# Altium schematic sheet STM32 BOARD.SchDoc
size B
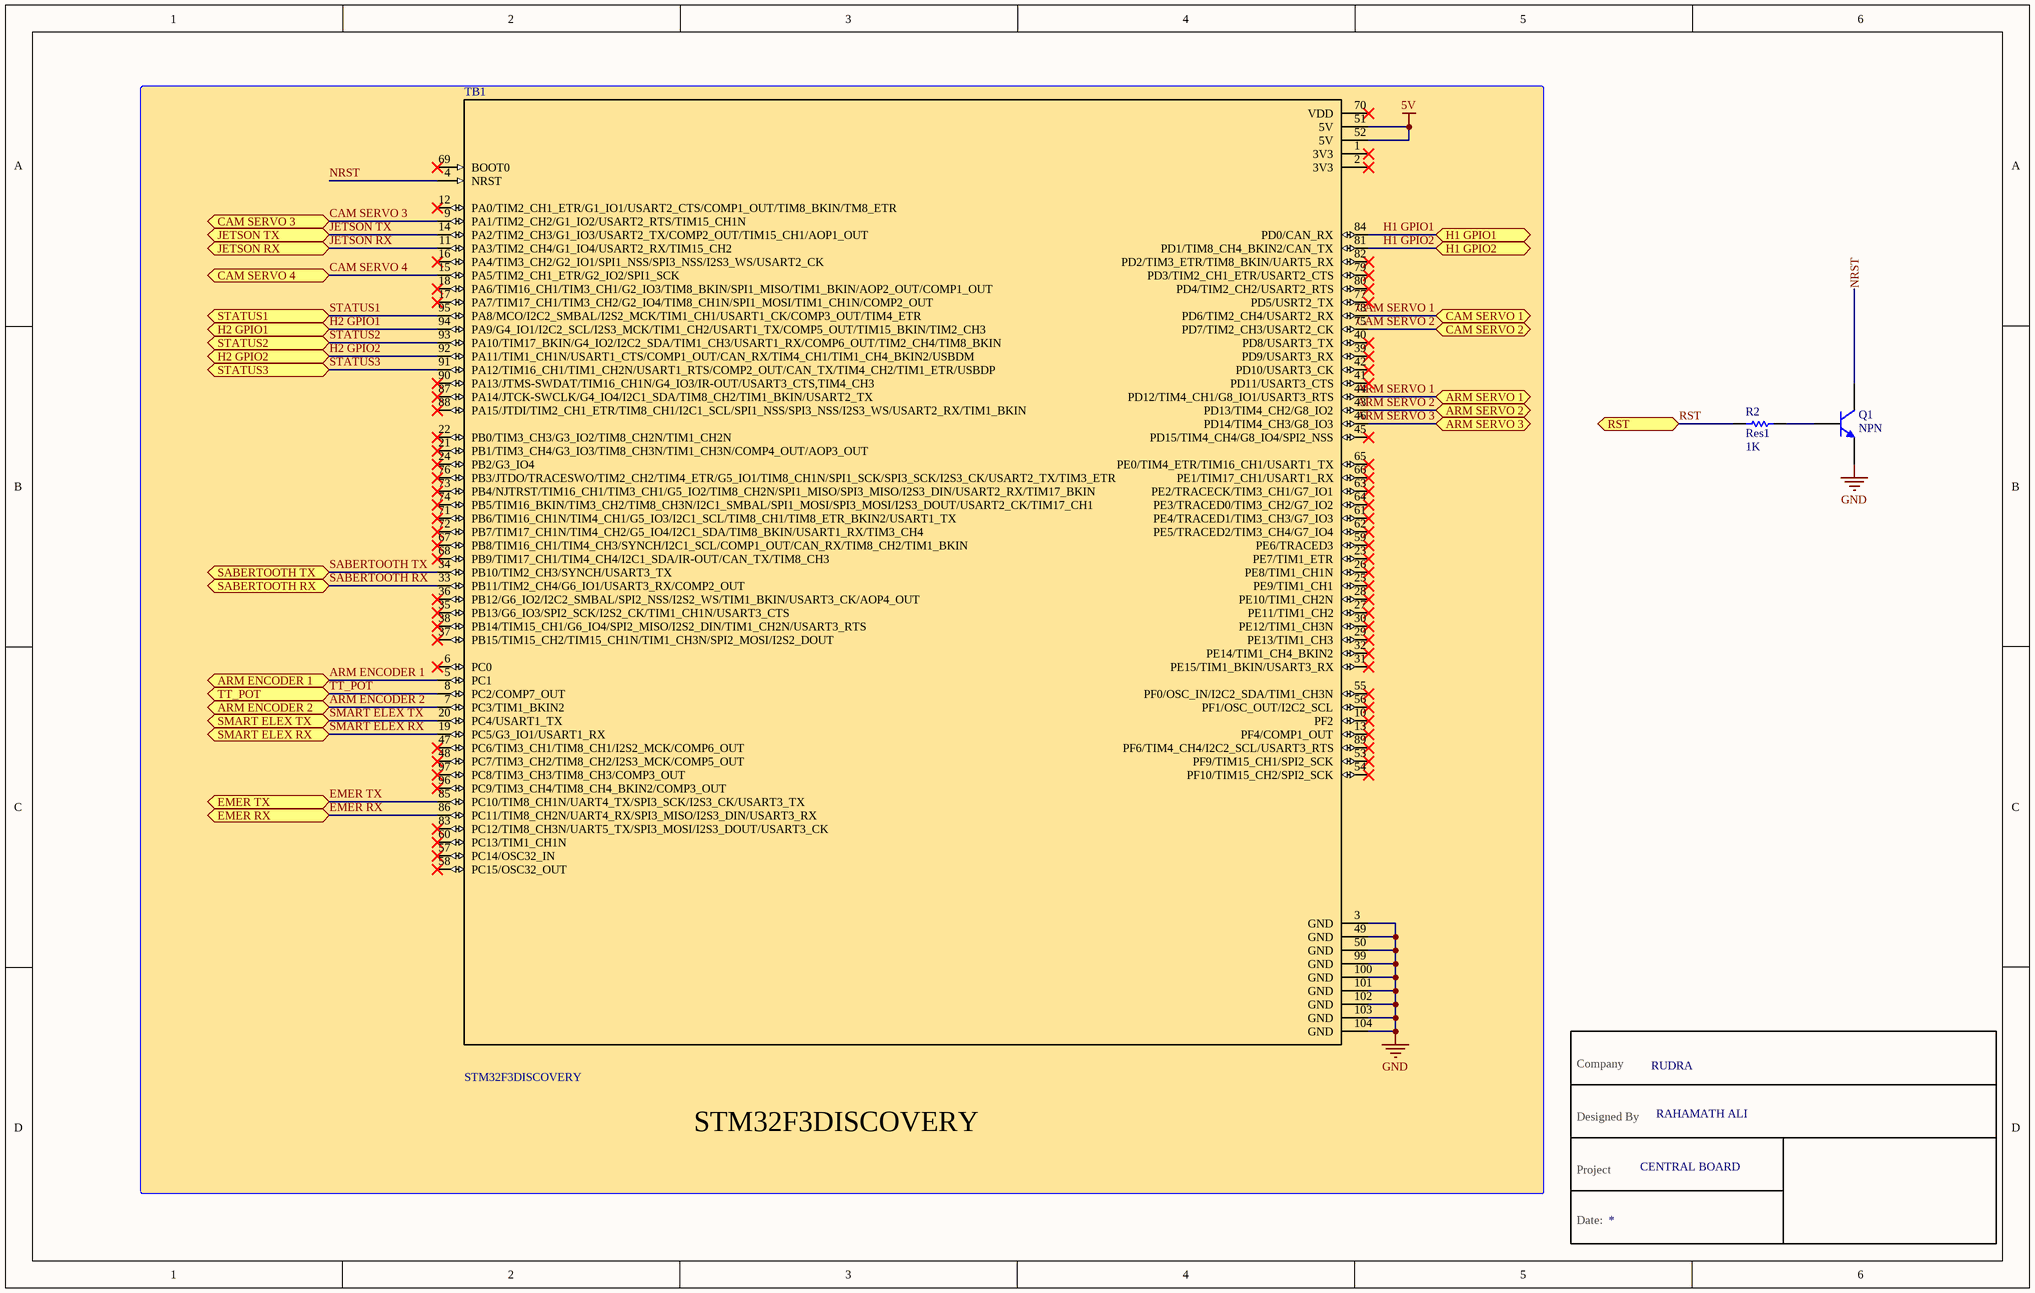
[diagram p0: STM32 BOARD.SchDoc]

## Parts
1  Project: CENTRAL BOARD  Designed By: RAHAMATH ALI  Company: RUDRA  (hidden comment: Schematic Table)  (graphical)
Q1  NPN  [TO-226-AA]
R2  Res1  value 1K  [AXIAL-0.3]
TB1  STM32F3DISCOVERY  [SHIELD_STM32F3DISCOVERY]

## Blocks framed on the sheet
STM32F3DISCOVERY: TB1

## Ports
ARM ENCODER 1 (bidir), ARM ENCODER 2 (bidir), ARM SERVO 1 (bidir), ARM SERVO 2 (bidir), ARM SERVO 3 (bidir), CAM SERVO 1 (bidir), CAM SERVO 2 (bidir), CAM SERVO 3 (bidir), CAM SERVO 4 (bidir), EMER RX (bidir), EMER TX (bidir), H1 GPIO1 (bidir), H1 GPIO2 (bidir), H2 GPIO1 (bidir), H2 GPIO2 (bidir), JETSON RX (bidir), JETSON TX (bidir), RST (bidir), SABERTOOTH RX (bidir), SABERTOOTH TX (bidir), SMART ELEX RX (bidir), SMART ELEX TX (bidir), STATUS1 (bidir), STATUS2 (bidir), STATUS3 (bidir), TT_POT (bidir)

## Nets
5V: TB1.51(5V) TB1.52(5V)
GND: Q1.3(E) TB1.3(GND) TB1.49(GND) TB1.50(GND) TB1.99(GND) TB1.100(GND) TB1.101(GND) TB1.102(GND) TB1.103(GND) TB1.104(GND)
ARM ENCODER 1: TB1.5(PC1) ; port ARM ENCODER 1
ARM ENCODER 2: TB1.7(PC3/TIM1_BKIN2) ; port ARM ENCODER 2
ARM SERVO 1: TB1.44(PD12/TIM4_CH1/G8_IO1/USART3_RTS) ; port ARM SERVO 1
ARM SERVO 2: TB1.43(PD13/TIM4_CH2/G8_IO2) ; port ARM SERVO 2
ARM SERVO 3: TB1.46(PD14/TIM4_CH3/G8_IO3) ; port ARM SERVO 3
CAM SERVO 1: TB1.78(PD6/TIM2_CH4/USART2_RX) ; port CAM SERVO 1
CAM SERVO 2: TB1.75(PD7/TIM2_CH3/USART2_CK) ; port CAM SERVO 2
CAM SERVO 3: TB1.9(PA1/TIM2_CH2/G1_IO2/USART2_RTS/TIM15_CH1N) ; port CAM SERVO 3
CAM SERVO 4: TB1.15(PA5/TIM2_CH1_ETR/G2_IO2/SPI1_SCK) ; port CAM SERVO 4
EMER RX: TB1.86(PC11/TIM8_CH2N/UART4_RX/SPI3_MISO/I2S3_DIN/USART3_RX) ; port EMER RX
EMER TX: TB1.85(PC10/TIM8_CH1N/UART4_TX/SPI3_SCK/I2S3_CK/USART3_TX) ; port EMER TX
H1 GPIO1: TB1.84(PD0/CAN_RX) ; port H1 GPIO1
H1 GPIO2: TB1.81(PD1/TIM8_CH4_BKIN2/CAN_TX) ; port H1 GPIO2
H2 GPIO1: TB1.94(PA9/G4_IO1/I2C2_SCL/I2S3_MCK/TIM1_CH2/USART1_TX/COMP5_OUT/TIM15_BKIN/TIM2_CH3) ; port H2 GPIO1
H2 GPIO2: TB1.92(PA11/TIM1_CH1N/USART1_CTS/COMP1_OUT/CAN_RX/TIM4_CH1/TIM1_CH4_BKIN2/USBDM) ; port H2 GPIO2
JETSON RX: TB1.11(PA3/TIM2_CH4/G1_IO4/USART2_RX/TIM15_CH2) ; port JETSON RX
JETSON TX: TB1.14(PA2/TIM2_CH3/G1_IO3/USART2_TX/COMP2_OUT/TIM15_CH1/AOP1_OUT) ; port JETSON TX
NRST: Q1.1(C) TB1.4(NRST)
RST: R2.1 ; port RST
SABERTOOTH RX: TB1.33(PB11/TIM2_CH4/G6_IO1/USART3_RX/COMP2_OUT) ; port SABERTOOTH RX
SABERTOOTH TX: TB1.34(PB10/TIM2_CH3/SYNCH/USART3_TX) ; port SABERTOOTH TX
SMART ELEX RX: TB1.19(PC5/G3_IO1/USART1_RX) ; port SMART ELEX RX
SMART ELEX TX: TB1.20(PC4/USART1_TX) ; port SMART ELEX TX
STATUS1: TB1.95(PA8/MCO/I2C2_SMBAL/I2S2_MCK/TIM1_CH1/USART1_CK/COMP3_OUT/TIM4_ETR) ; port STATUS1
STATUS2: TB1.93(PA10/TIM17_BKIN/G4_IO2/I2C2_SDA/TIM1_CH3/USART1_RX/COMP6_OUT/TIM2_CH4/TIM8_BKIN) ; port STATUS2
STATUS3: TB1.91(PA12/TIM16_CH1/TIM1_CH2N/USART1_RTS/COMP2_OUT/CAN_TX/TIM4_CH2/TIM1_ETR/USBDP) ; port STATUS3
TT_POT: TB1.8(PC2/COMP7_OUT) ; port TT_POT
NetQ1_2: Q1.2(B) R2.2

Not connected (* = marked no-connect by the designer): TB1 1(3V3)* 2(3V3)* 6(PC0)* 10(PF2)* 12(PA0/TIM2_CH1_ETR/G1_IO1/USART2_CTS/COMP1_OUT/TIM8_BKIN/TM8_ETR)* 13(PF4/COMP1_OUT)* 16(PA4/TIM3_CH2/G2_IO1/SPI1_NSS/SPI3_NSS/I2S3_WS/USART2_CK)* 17(PA7/TIM17_CH1/TIM3_CH2/G2_IO4/TIM8_CH1N/SPI1_MOSI/TIM1_CH1N/COMP2_OUT)* 18(PA6/TIM16_CH1/TIM3_CH1/G2_IO3/TIM8_BKIN/SPI1_MISO/TIM1_BKIN/AOP2_OUT/COMP1_OUT)* 21(PB1/TIM3_CH4/G3_IO3/TIM8_CH3N/TIM1_CH3N/COMP4_OUT/AOP3_OUT)* 22(PB0/TIM3_CH3/G3_IO2/TIM8_CH2N/TIM1_CH2N)* 23(PE7/TIM1_ETR)* 24(PB2/G3_IO4)* 25(PE9/TIM1_CH1)* 26(PE8/TIM1_CH1N)* 27(PE11/TIM1_CH2)* 28(PE10/TIM1_CH2N)* 29(PE13/TIM1_CH3)* 30(PE12/TIM1_CH3N)* 31(PE15/TIM1_BKIN/USART3_RX)* 32(PE14/TIM1_CH4_BKIN2)* 35(PB13/G6_IO3/SPI2_SCK/I2S2_CK/TIM1_CH1N/USART3_CTS)* 36(PB12/G6_IO2/I2C2_SMBAL/SPI2_NSS/I2S2_WS/TIM1_BKIN/USART3_CK/AOP4_OUT)* 37(PB15/TIM15_CH2/TIM15_CH1N/TIM1_CH3N/SPI2_MOSI/I2S2_DOUT)* 38(PB14/TIM15_CH1/G6_IO4/SPI2_MISO/I2S2_DIN/TIM1_CH2N/USART3_RTS)* 39(PD9/USART3_RX)* 40(PD8/USART3_TX)* 41(PD11/USART3_CTS)* 42(PD10/USART3_CK)* 45(PD15/TIM4_CH4/G8_IO4/SPI2_NSS)* 47(PC6/TIM3_CH1/TIM8_CH1/I2S2_MCK/COMP6_OUT)* 48(PC7/TIM3_CH2/TIM8_CH2/I2S3_MCK/COMP5_OUT)* 53(PF9/TIM15_CH1/SPI2_SCK)* 54(PF10/TIM15_CH2/SPI2_SCK)* 55(PF0/OSC_IN/I2C2_SDA/TIM1_CH3N)* 56(PF1/OSC_OUT/I2C2_SCL)* 57(PC14/OSC32_IN)* 58(PC15/OSC32_OUT)* 59(PE6/TRACED3)* 60(PC13/TIM1_CH1N)* 61(PE4/TRACED1/TIM3_CH3/G7_IO3)* 62(PE5/TRACED2/TIM3_CH4/G7_IO4)* 63(PE2/TRACECK/TIM3_CH1/G7_IO1)* 64(PE3/TRACED0/TIM3_CH2/G7_IO2)* 65(PE0/TIM4_ETR/TIM16_CH1/USART1_TX)* 66(PE1/TIM17_CH1/USART1_RX)* 67(PB8/TIM16_CH1/TIM4_CH3/SYNCH/I2C1_SCL/COMP1_OUT/CAN_RX/TIM8_CH2/TIM1_BKIN)* 68(PB9/TIM17_CH1/TIM4_CH4/I2C1_SDA/IR-OUT/CAN_TX/TIM8_CH3)* 69(BOOT0)* 70(VDD)* 71(PB6/TIM16_CH1N/TIM4_CH1/G5_IO3/I2C1_SCL/TIM8_CH1/TIM8_ETR_BKIN2/USART1_TX)* 72(PB7/TIM17_CH1N/TIM4_CH2/G5_IO4/I2C1_SDA/TIM8_BKIN/USART1_RX/TIM3_CH4)* 73(PB4/NJTRST/TIM16_CH1/TIM3_CH1/G5_IO2/TIM8_CH2N/SPI1_MISO/SPI3_MISO/I2S3_DIN/USART2_RX/TIM17_BKIN)* 74(PB5/TIM16_BKIN/TIM3_CH2/TIM8_CH3N/I2C1_SMBAL/SPI1_MOSI/SPI3_MOSI/I2S3_DOUT/USART2_CK/TIM17_CH1)* 76(PB3/JTDO/TRACESWO/TIM2_CH2/TIM4_ETR/G5_IO1/TIM8_CH1N/SPI1_SCK/SPI3_SCK/I2S3_CK/USART2_TX/TIM3_ETR)* 77(PD5/USRT2_TX)* 79(PD3/TIM2_CH1_ETR/USART2_CTS)* 80(PD4/TIM2_CH2/USART2_RTS)* 82(PD2/TIM3_ETR/TIM8_BKIN/UART5_RX)* 83(PC12/TIM8_CH3N/UART5_TX/SPI3_MOSI/I2S3_DOUT/USART3_CK)* 87(PA14/JTCK-SWCLK/G4_IO4/I2C1_SDA/TIM8_CH2/TIM1_BKIN/USART2_TX)* 88(PA15/JTDI/TIM2_CH1_ETR/TIM8_CH1/I2C1_SCL/SPI1_NSS/SPI3_NSS/I2S3_WS/USART2_RX/TIM1_BKIN)* 89(PF6/TIM4_CH4/I2C2_SCL/USART3_RTS)* 90(PA13/JTMS-SWDAT/TIM16_CH1N/G4_IO3/IR-OUT/USART3_CTS,TIM4_CH3)* 96(PC9/TIM3_CH4/TIM8_CH4_BKIN2/COMP3_OUT)* 97(PC8/TIM3_CH3/TIM8_CH3/COMP3_OUT)*

## Notes on the sheet
- (in symbol Schematic Table) Company; Designed By; Project; Date:

## Library data of the parts
Q1 = NPN: NPN Bipolar Transistor; Published: 8-Jun-2000; LatestRevisionDate: 17-Jul-2002; LatestRevisionNote: Re-released for DXP Platform.; PackageReference: TO-226-AA; Publisher: Altium Limited; PackageDescription: TO, Flat Index; 3 In-Line, Axial Leads; Body Dia. 4.8mm; Leads 0.55 x 0.51 mm (max); Code_JEDEC: TO-226-AA
R2 = Res1: Resistor; Published: 8-Jun-2000; LatestRevisionDate: 17-Jul-2002; LatestRevisionNote: Re-released for DXP Platform.; PackageReference: AXIAL-0.3; Publisher: Altium Limited; PackageDescription: Axial Device, Thru-Hole; 2 Leads; 0.3 in Pin Spacing
TB1 = STM32F3DISCOVERY: / STM32F303VCT6 Discovery STM32F3 ARMÂ® CortexÂ®-M4 MCU 32-Bit Embedded Evaluation Board /; MF: STMicroelectronics; Price: None; MP: STM32F3DISCOVERY; Package: LQFP-100 STMicroelectronics; SnapEDA_Link: https://www.snapeda.com/parts/STM32F3DISCOVERY/STMicroelectronics/view-part/10815/?ref=snap; Availability: Unavailable; Value: *